# Altium project PCB_Project.PrjPcb
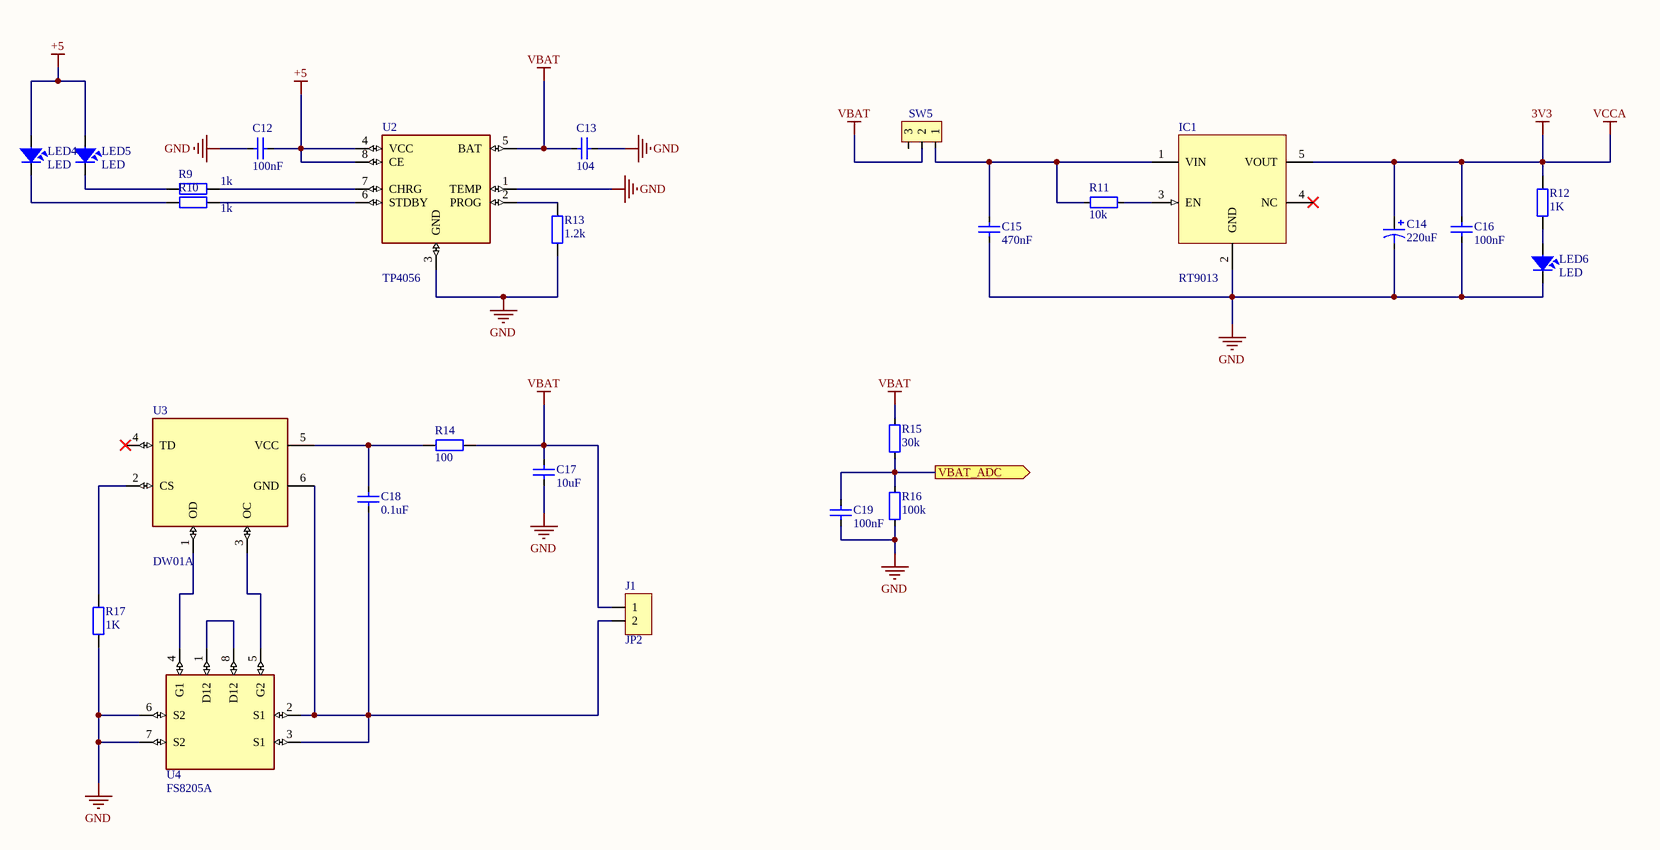
[diagram p0: [2]POWER.SchDoc]
1 sheet, 26 parts. Net scope: flat (ports and power ports of the same name join across sheets).
Board file: PCB1.PcbDoc

## Sheet [2]POWER.SchDoc
size B

### Parts
C12  100nF  [CAP_0805]
C13  104  [CAP_0805]
C14  220uF  [c5mm]
C15  470nF  [CAP_0805]
C16  100nF  [CAP_0805]
C17  10uF  [CAP_0805]
C18  0.1uF  [CAP_0805]
C19  100nF  [CAP_0805]
IC1  RT9013  [SOT23-5]
J1  JP2  [JP2-D1T]
LED4  LED  [LED-0805-Green]
LED5  LED  [LED-0805-Red]
LED6  LED  [LED-0805-Blue]
R9  1k  [RES_SMD_0805]
R10  1k  [RES_SMD_0805]
R11  10k  [RES_SMD_0805]
R12  1K  [RES-SMD-0805]
R13  1.2k  [RES_SMD_0805]
R14  100  [RES_SMD_0805]
R15  30k  [RES_SMD_0805]
R16  100k  [RES_SMD_0805]
R17  1K  [RES_SMD_0805]
SW5  SW3  [JP3]  (value not drawn)
U2  TP4056  [TP4056]
U3  DW01A  [SOT23-6]
U4  FS8205A  [FS8205A]

### Ports
VBAT_ADC (out)

### Nets
3V3: C14.1 C16.1 IC1.5(VOUT) R12.1  [also labelled VCCA]
+5: C12.2 LED4.1 LED5.1 U2.4(VCC) U2.8(CE)
GND: C12.1 C13.2 C14.2 C15.2 C16.2 C17.1 C19.1 IC1.2(GND) LED6.2 R13.2 R16.2 R17.2 U2.1(TEMP) U2.3(GND) U4.6(S2) U4.7(S2)
VBAT: C13.1 C17.2 J1.1 R14.1 R15.1 SW5.2 U2.5(BAT)
NetC15_1: C15.1 IC1.1(VIN) R11.2 SW5.1
NetC18_1: C18.1 J1.2 U3.6(GND) U4.2(S1) U4.3(S1)
NetC18_2: C18.2 R14.2 U3.5(VCC)
NetC19_2: C19.2 R15.2 R16.1 ; port VBAT_ADC
NetIC1_3: IC1.3(EN) R11.1
NetLED4_2: LED4.2 R10.2
NetLED5_2: LED5.2 R9.2
NetLED6_1: LED6.1 R12.2
NetR9_1: R9.1 U2.7(CHRG)
NetR10_1: R10.1 U2.6(STDBY)
NetR13_1: R13.1 U2.2(PROG)
NetR17_1: R17.1 U3.2(CS)
NetU3_1: U3.1(OD) U4.4(G1)
NetU3_3: U3.3(OC) U4.5(G2)
NetU4_1: U4.1(D12) U4.8(D12)

Not connected (* = marked no-connect by the designer): IC1 4(NC)*; SW5 3; U3 4(TD)*

### Library data of the parts
C12 C13 C15-C19 = CapSMD: Capacitor; Value: 33p; Published: 8-Jun-2000; LatestRevisionDate: 17-Jul-2002; LatestRevisionNote: Re-released for DXP Platform.; PackageReference: RAD-0.3; Publisher: Altium Limited
C14 = Cap Pol: Polarized Capacitor (Axial); Published: 8-Jun-2000; LatestRevisionDate: 17-Jul-2002; LatestRevisionNote: Re-released for DXP Platform.; PackageReference: POLAR0.8; Publisher: Altium Limited
IC1 = RT9013: RT9013-33GB IC REG LINEAR 3.3V 500mA SOT23-5
J1 = JP2: WR-PHD 2.54 mm Angled Socket Header; Manufacturer: W¨¹rth Elektronik eiSos GmbH; partNo: 613002143121; ComponentLink1 Description: Manufacturer; ComponentLink2 Description: Datasheet; NoPins: 02; Created Date: 29 March 2013; ComponentLink1URL: http://www.we-online.com; ComponentLink2URL: http://katalog.we-online.de/em/datasheet/6130xx143121.pdf; Created by: Karrer Zheng
LED4-LED6 = LED: LED Single colour Green and Red; Value: LED 3 ly Single Colour
R9 R10 R12-R14 R17 = Resistor - SMD: Resistor SMD; Manufacturer: Generic Components; Class: Passive; Published: 08/06/2000; Publisher: Altium Hobart Technology Centre
R11 R15 R16 = Resistor - SMD: Resistor; Manufacturer: Generic Components; Class: Passive; Published: 08/06/2000; Publisher: Altium Hobart Technology Centre
U2 = TP4056: Complete single cell Li-Ion battery with a constant current / constant voltage linear charger
U3 = DW01A: One Cell Lithium-ion/Polymer Battery Protection IC